# Altium project Regulator MP1584EN.PrjPcb
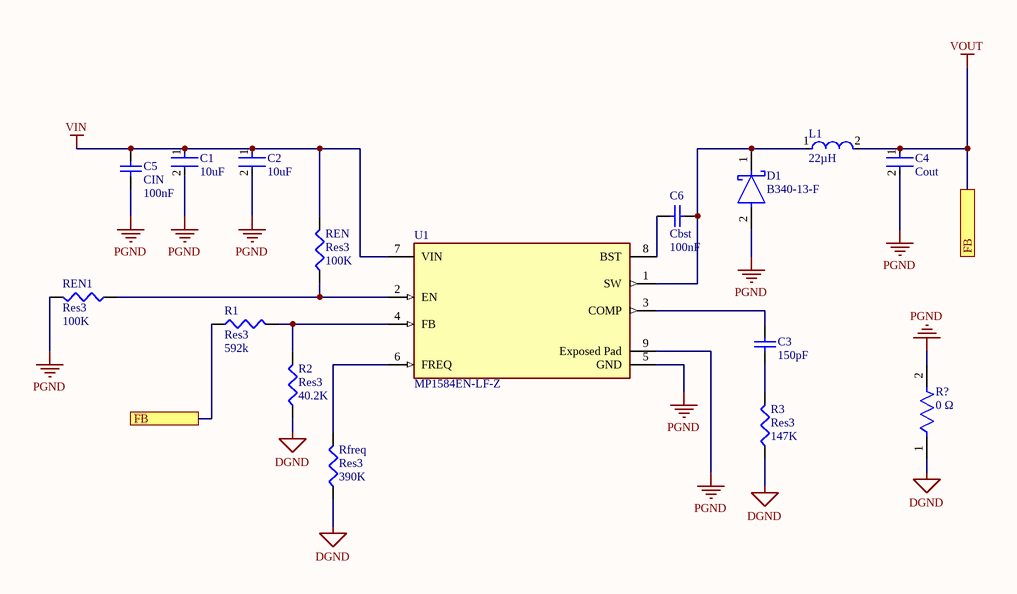
[diagram p0: Regulator MP1584EN.SchDoc]
1 sheet, 16 parts. Net scope: flat (ports and power ports of the same name join across sheets).
Board file: Regulator MP1584EN.PcbDoc

## Sheet Regulator MP1584EN.SchDoc
size A4; SheetNumber: 1; SheetTotal: 1; SPICEModelCacheRDLMUCLI: <root> / <DocumentId>RDLMUCLI</DocumentId> / <CacheFrame Number="0"> / <Model Name="cap" Kind="MDL"> / <Text>*Default semiconductor capacitor / .MODEL CAP C()</Text> / </Model> / </CacheFrame> / </root>

### Parts
C1  10uF  [FP-C1206C-EB-MFG]
C2  10uF  [FP-C1206C-EB-MFG]
C3  value 150pF  [C1206]
C4  Cout  [FP-CL10-IPC_B]
C5  CIN  value 100nF  [C1206]
C6  Cbst  value 100nF  [C1206]
D1  B340-13-F  [FP-SMC-MFG]
L1  22µH  [FP-NR4012-MFG]
R1  Res3  value 592k  [J1-0603]
R2  Res3  value 40.2K  [J1-0603]
R3  Res3  value 147K  [J1-0603]
R?  0 Ω  [FP-MCT0603-IPC_C]
REN  Res3  value 100K  [J1-0603]
REN1  Res3  value 100K  [J1-0603]
Rfreq  Res3  value 390K  [J1-0603]
U1  MP1584EN-LF-Z  [FP-MP1584EN-LF-Z-MFG]

### Ports
FB (see Regulator MP1584EN[1B]), FB (see Regulator MP1584EN[4B])

### Nets
DGND: R2.1 R3.1 R?.1 Rfreq.1
PGND: C1.2 C2.2 C4.2 C5.1 D1.2(A) R?.2 REN1.2 U1.5(GND) U1.9(Exposed_Pad)
VIN: C1.1 C2.1 C5.2 REN.2 U1.7(VIN)
VOUT: C4.1 L1.2 R1.1 ; port FB
NetC3_1: C3.1 R3.2
NetC3_2: C3.2 U1.3(COMP)
NetC6_1: C6.1 U1.8(BST)
NetC6_2: C6.2 D1.1(C) L1.1 U1.1(SW)
NetR1_2: R1.2 R2.2 U1.4(FB)
NetREN_1: REN.1 REN1.1 U1.2(EN)
NetRfreq_2: Rfreq.2 U1.6(FREQ)

### Library data of the parts
C1 C2 = CMP-03020-005759-1: CAP CER 10UF 50V X7R 1206; Manufacturer: KEMET; Manufacturer Part Number: C1206C104K5RACAUTO; Capacitance: 10 μF; Temperature Coefficient: 15%; Value: 10 μF; Material: Ceramic; Automotive Grade: Grade 0; Tolerance: 0.1; RoHS: TRUE; Lead Free: Yes; ComponentLink2Description: Datasheet; Automotive: Yes; Temperature Characteristic: X7R; Temperature Range Low: -55°C; Voltage Rating: 50 V; Device Class L1: Passive Components; Ipc Land Pattern Name: CAPC320160X78; Mouser Description: Multilayer Ceramic Capacitors MLCC - SMD/SMT 0.1uF 50volts 10% X7R AUTO; Octopart: https://octopart.com/c1206c104k5racauto-kemet-12595586; Device Class L3: Ceramic Capacitors; Digikey Description: CAP CER 0.1UF 50V X7R 1206; Temperature Range High: +150°C; Temperature: -55°C to +150°C; Device Class L2: Capacitors; ComponentLink2URL: https://content.kemet.com/datasheets/KEM_C1007_X8R_ULTRA_150C_SMD.pdf; Package: C1206C-EB; Category: Cap; Height: 0.88mm
C3 C5 C6 = Cap Semi: Capacitor (Semiconductor SIM Model); Published: 8-Jun-2000; LatestRevisionDate: 29-May-2009; LatestRevisionNote: IPC-7351 Footprint Added.; PackageReference: C1206; Publisher: Altium Limited; PackageDescription: Chip Capacitor
C4 = CMP-13271-002500-1: Cap Ceramic 22uF 6.3V X5R ±20% Pad SMD 0603 +85°C T/R
D1 = CMP-12790-000049-1: DIODE SCHOTTKY 40V 3A SMC; Manufacturer: Diodes Inc.; Max Surge Forward Current: 100A; Peak Reverse Current: 0.1mA; Max Junction Temp: +150°C; Value: 200pF; Standoff Height: 0.1mm; Temperature: -55°C to +150°C; Reverse Voltage: 40V; Max Repetitive Reverse Voltage: 40V; Forward Current: 3A; Device Class L2: Diodes; RoHS: TRUE; Footprint Url: https://www.diodes.com/assets/Package-Files/SMC.pdf; Digikey Description: DIODE SCHOTTKY 40V 3A SMC; Package: SMC; Category: Diode; ComponentLink2Description: Datasheet; Temperature Range High: +150°C; Lead Free: Yes; Mouser Description: Diode Schottky 40V 3A 2-Pin SMC T/R Diode Schottky 40V 3A 2-Pin SMC T/R; Manufacturer Part Number: B340-13-F; Octopart: https://octopart.com/b340-13-f-diodes+inc.-325814; Automotive: No; ComponentLink2URL: https://www.diodes.com/assets/Datasheets/ds30923.pdf; Capacitance: 200pF; Device Class L1: Discrete Semiconductors; Temperature Range Low: -55°C; Height: 2.5mm; Device Class L3: Schottky Diodes
L1 = CMP-14484-000628-1: SMD Power Inductors 22uH ±20% 0.5A 0.48Ω; Test Frequency: 100kHz; DC Resistance (DCR): 480mR; Shielding: Shielded; Saturation Current: 500mA; RMS Current (Irms): 620mA; Core Material: Ferrite; Self Resonant Frequency: 18MHz; Tolerance: 20%; Inductance Tolerance: 20%; Mount: Surface Mount; Resistor Type: Wirewound; Lead Pitch: 2.8mm; Depth: 4.2mm; Termination: SMD/SMT; Inductance: 22uH; Width: 0.157inch; Number of Pins: 2; Max Operating Temperature: 125°C; Case/Package: Nonstandard; Min Operating Temperature: -25°C; Lead Free: Lead Free; Series: NRS; Height: 1.2mm; Max DC Current: 500mA; Current Rating: 620mA; Package Quantity: 4500; Length: 4mm; RoHS Compliant: Yes; Height - Seated (Max): 0.047inch; Halogen Free: Halogen Free; Packaging: Tape and Reel; Radiation Hardening: No
R1-R3 REN REN1 Rfreq = Res3: Resistor; Published: 8-Jun-2000; LatestRevisionDate: 29-May-2009; LatestRevisionNote: IPC-7351 Footprint Added.; PackageReference: J1-0603; Publisher: Altium Limited; PackageDescription: Chip Resistor
R? = CMP-02407-001385-1: RES SMD 100 OHM 1% 1/8W 0603; Voltage Rating (DC): 75V; Resistance: 0mR; Max Power Dissipation: 125mW; Power Rating: 100mW; Case Code (Imperial): 0603; Packaging: Tape and Reel; Length: 1.55mm; Case Code (Metric): 1608; Military Standard: Not; Lead Free: Lead Free; Width: 0.033inch; Voltage Rating: 75V; Case/Package: 0603; Composition: Thin Film; Radiation Hardening: No; Depth: 0.85mm; Max Operating Temperature: 125°C; Number of Terminations: 2; Height: 0.022inch; REACH SVHC: No SVHC; Mount: Surface Mount; Package Quantity: 1; Contact Plating: Tin; Min Operating Temperature: -55°C
U1 = CMP-57379-000006-1: IC REG BUCK ADJ 3A; Manufacturer: Monolithic Power Systems; Output Type: AdjustableProgrammable; Nominal Supply Current: 100uA; Switching Frequency: 100-1500kHz; Max Power Dissipation: 2.5W; Output Voltage: 0.8-25V; Max Junction Temp: +125°C; Min Supply Voltage: 4.5V; Max Supply Voltage: 28V; Number Of Outputs: 1; Standoff Height: 0mm; ComponentLink2URL: https://www.monolithicpower.com/en/documentview/productdocument/index/doc_url/L01QMTU4NF9yMS4wLnBkZg%3D%3D/release_date/MjAwOS0wNC0wOSAwMDowMDowMA%3D%3D/; Lead Free: Yes; Package: MP1584EN-LF-Z; Temperature Range Low: -20°C; Temperature: -20°C to +125°C; Height: 1.7mm; Ambient Temperature Range Low: -20°C; RoHS: TRUE; Automotive: No; Ipc Land Pattern Name: SOIC127P600X150-8; Ambient Temperature Range High: +85°C; Device Class L2: Power Management ICs; ComponentLink2Description: Datasheet; Manufacturer Part Number: MP1584EN-LF-Z; Device Class L3: Voltage Regulators - Switching; Octopart: https://octopart.com/mp1584en-lf-z-monolithic+power+systems-18629680; Category: IC; Output Current: 3A; Digikey Description: IC REG BUCK ADJ 3A; Temperature Range High: +125°C; Device Class L1: Integrated Circuits (ICs); Switching Topology: Buck